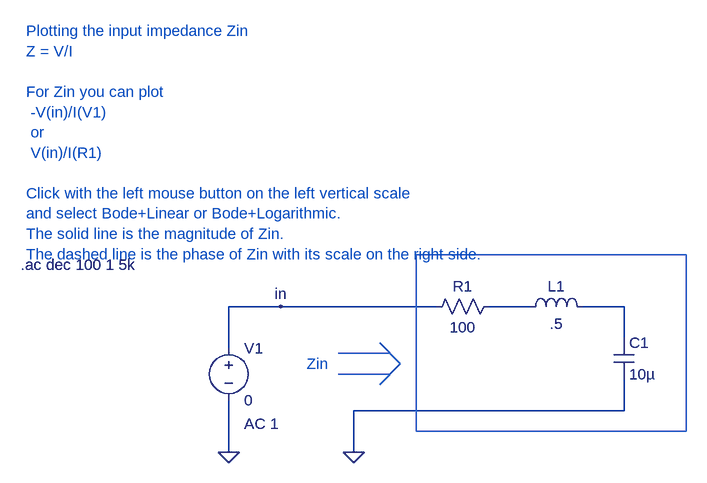
[diagram p0: schematic Zin_Rlc.asc]
Zin_Rlc.asc, the LTspice schematic file:
Version 4
SHEET 1 880 680
WIRE 16 224 -64 224
WIRE 256 224 16 224
WIRE 400 224 336 224
WIRE 544 224 480 224
WIRE 544 272 544 224
WIRE -64 288 -64 224
WIRE 544 384 544 336
WIRE 544 384 128 384
WIRE -64 448 -64 368
WIRE 128 448 128 384
FLAG 128 448 0
FLAG -64 448 0
FLAG 16 224 in
SYMBOL res 240 240 R270
WINDOW 0 32 56 VTop 0
WINDOW 3 0 56 VBottom 0
SYMATTR InstName R1
SYMATTR Value 100
SYMBOL ind 384 240 R270
WINDOW 0 32 56 VTop 0
WINDOW 3 5 56 VBottom 0
WINDOW 39 -23 56 VBottom 0
SYMATTR InstName L1
SYMATTR Value .5
SYMBOL cap 528 272 R0
SYMATTR InstName C1
SYMATTR Value 10µ
SYMBOL voltage -64 272 R0
WINDOW 123 24 132 Left 0
WINDOW 39 0 0 Left 0
SYMATTR InstName V1
SYMATTR Value 0
SYMATTR Value2 AC 1
TEXT -384 160 Left 0 !.ac dec 100 1 5k
TEXT -376 -200 Left 0 ;Plotting the input impedance Zin\nZ = V/I\n \nFor Zin you can plot \n -V(in)/I(V1)\n or \n V(in)/I(R1)\n \nClick with the left mouse button on the left vertical scale \nand select Bode+Linear or Bode+Logarithmic.\nThe solid line is the magnitude of Zin.\nThe dashed line is the phase of Zin with its scale on the right side.
TEXT 56 312 Left 0 ;Zin
LINE Normal 184 296 104 296
LINE Normal 184 328 104 328
LINE Normal 168 280 200 312
LINE Normal 168 344 200 312
RECTANGLE Normal 640 416 224 144

The netlist it stands for:
* Zin_Rlc.asc
R1 in N001 100
L1 N001 N002 .5
C1 N002 0 10µ
V1 in 0 0 AC 1
.ac dec 100 1 5k
* Plotting the input impedance Zin
* Z = V/I
* For Zin you can plot
*  -V(in)/I(V1)
*  or
*  V(in)/I(R1)
* Click with the left mouse button on the left vertical scale
* and select Bode+Linear or Bode+Logarithmic.
* The solid line is the magnitude of Zin.
* The dashed line is the phase of Zin with its scale on the right side.
* Zin
.backanno
.end